# Altium project MB1404.PrjPcb (part 1 of 4)
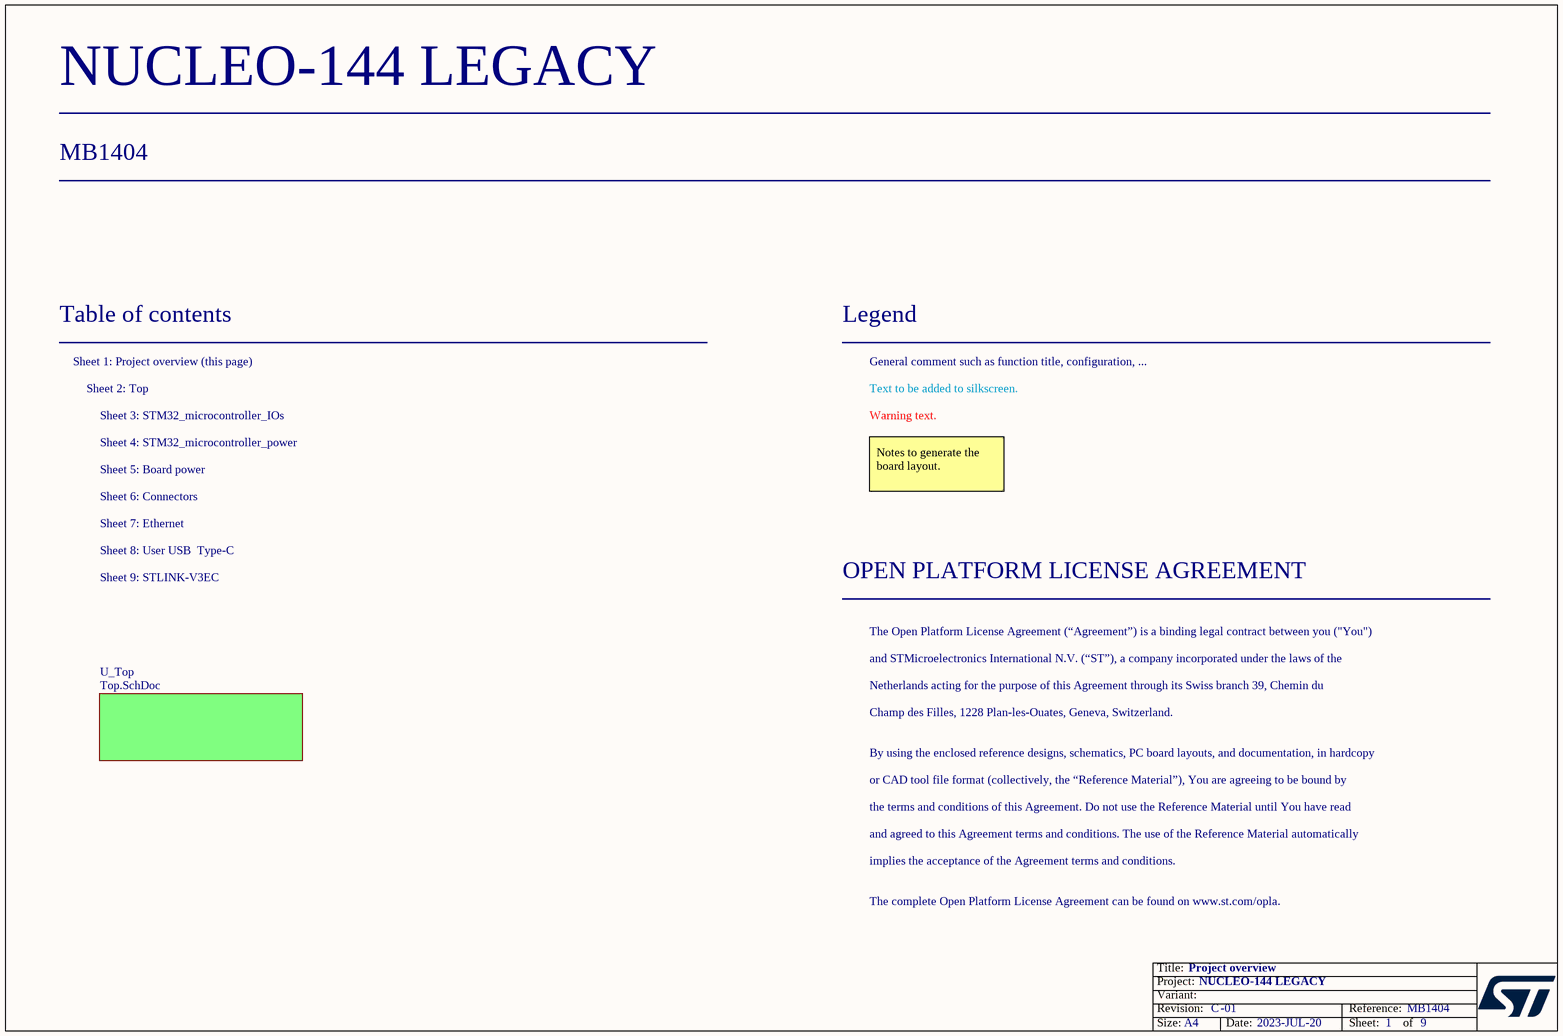
[diagram p0: Project_Overview.SchDoc]
Board_Assembly_Revision: 01; Board_Document_Date: 2023-JUL-20; Board_Name: NUCLEO-144 LEGACY; Board_PCB_Revision: C; Board_Reference: MB1404
9 sheets, 355 parts. Net scope: flat (ports and power ports of the same name join across sheets).
Board file: MB1404.PcbDoc
Sheets:
  Project_Overview.SchDoc
    U_Top = Top.SchDoc
      U_Connectors = Connectors.SchDoc
      U_USB = USB.SchDoc
      U_Ethernet = Ethernet.SchDoc
      U_STM32_microcontroller_power = STM32_microcontroller_power.SchDoc
      U_Board_power = Board_power.SchDoc
      U_STM32_microcontroller_IOs = STM32_microcontroller_IOs.SchDoc
      U_STLINK-V3EC = STLINK-V3EC.SchDoc

## Sheet Project_Overview.SchDoc: Project overview
size A4; Date: Not used; ApprovedBy: Not used; CheckedBy: Not used; Author: Not used; CompanyName: STMicroelectronics; DrawnBy: Not used; Engineer: Not used; Organization: Not used; Address1: Not used; Address2: Not used; Address3: Not used; Address4: Not used; DocumentNumber: 1; Revision: Not used; SheetNumber: 1; SheetTotal: 9; CurrentTime: Not used; CurrentDate: Not used; Time: Not used; DocumentFullPathAndName: Not used; DocumentName: Not used; ModifiedDate: Not used; ImagePath: Not used; ProjectName: Not used; Application_BuildNumber: Not used

### Sub-sheets
U_Top = Top.SchDoc: no entries

### Notes on the sheet
- Table of contents
- Sheet 1: Project overview (this page)
- Legend
- General comment such as function title, configuration, ...
- Sheet 2: Top
- Sheet 4: STM32_microcontroller_power
- Sheet 3: STM32_microcontroller_IOs
- Text to be added to silkscreen.
- Warning text.
- Sheet 6: Connectors
- Sheet 5: Board power
- Notes to generate the board layout.
- Sheet 9: STLINK-V3EC
- Sheet 8: User USB  Type-C
- Sheet 7: Ethernet
- OPEN PLATFORM LICENSE AGREEMENT
- The Open Platform License Agreement (“Agreement”) is a binding legal contract between you ("You")
- and STMicroelectronics International N.V. (“ST”), a company incorporated under the laws of the
- Netherlands acting for the purpose of this Agreement through its Swiss branch 39, Chemin du
- Champ des Filles, 1228 Plan-les-Ouates, Geneva, Switzerland.
- By using the enclosed reference designs, schematics, PC board layouts, and documentation, in hardcopy
- or CAD tool file format (collectively, the “Reference Material”), You are agreeing to be bound by
- the terms and conditions of this Agreement. Do not use the Reference Material until You have read
- and agreed to this Agreement terms and conditions. The use of the Reference Material automatically
- implies the acceptance of the Agreement terms and conditions.
- The complete Open Platform License Agreement can be found on www.st.com/opla.
- Title:
- Project:
- Size:
- Revision:
- Variant:
- A4
- -
- Date:
- Reference:
- Sheet:
- of

## Sheet Top.SchDoc: Top
size A4; Date: Not used; ApprovedBy: Not used; CheckedBy: Not used; Author: Not used; CompanyName: STMicroelectronics; DrawnBy: Not used; Engineer: Not used; Organization: Not used; Address1: Not used; Address2: Not used; Address3: Not used; Address4: Not used; DocumentNumber: 2; Revision: Not used; SheetNumber: 2; SheetTotal: 9; CurrentTime: Not used; CurrentDate: Not used; Time: Not used; DocumentFullPathAndName: Not used; DocumentName: Not used; ModifiedDate: Not used; ImagePath: Not used; ProjectName: Not used; Application_BuildNumber: Not used
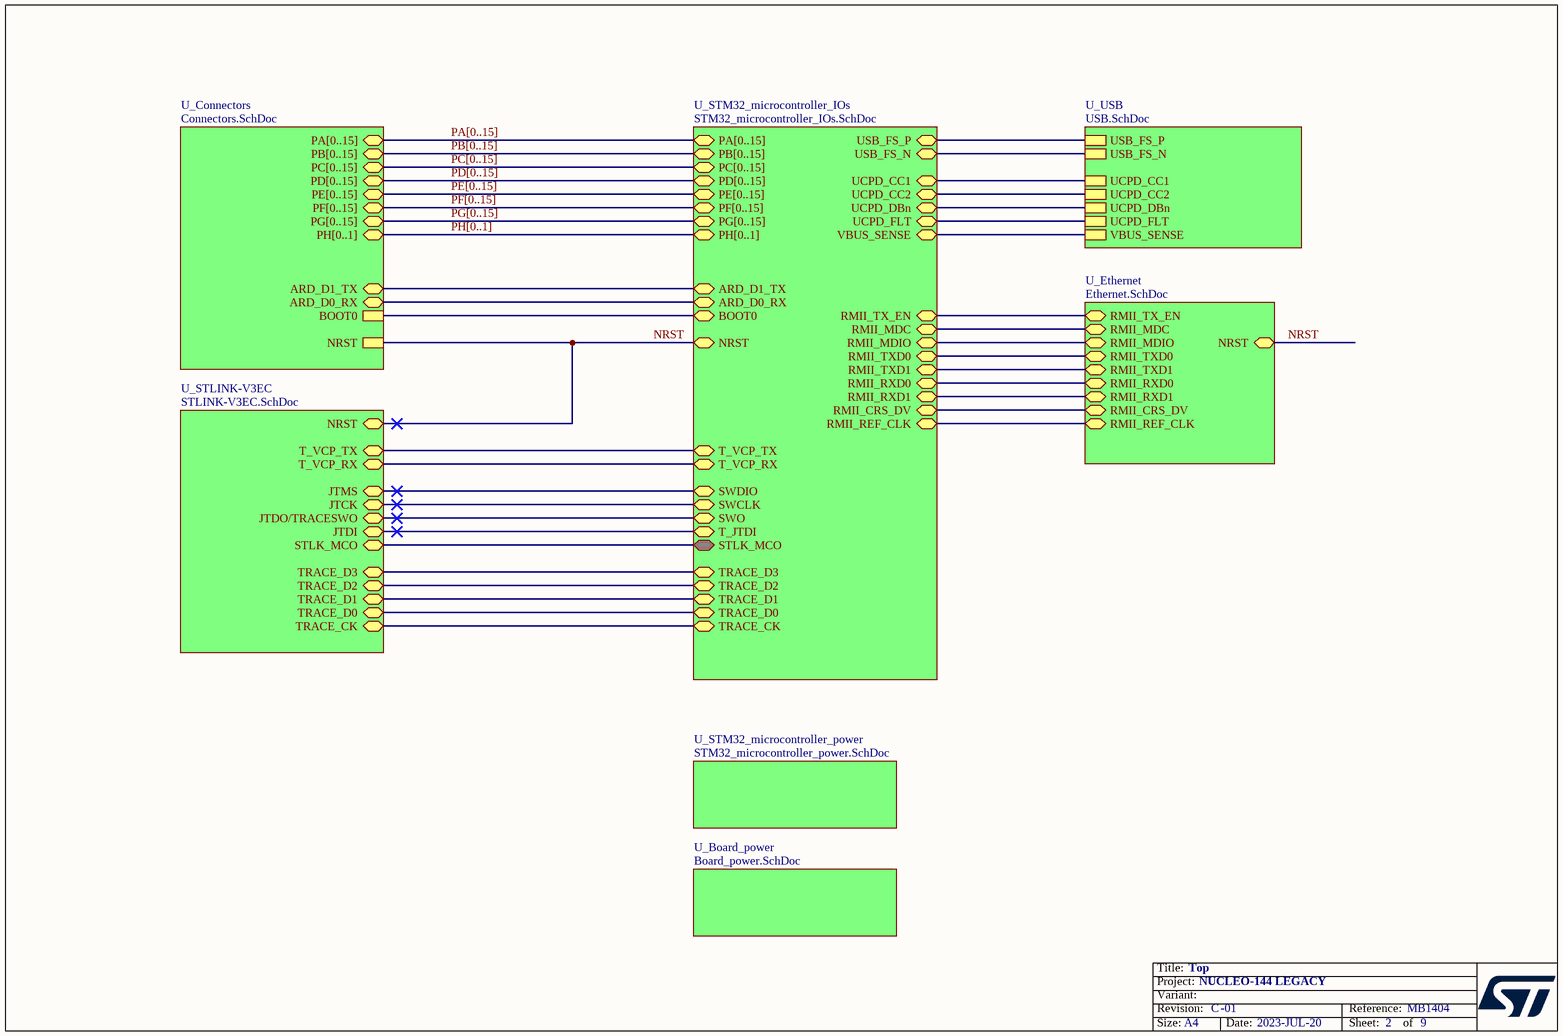
[diagram p1: Top.SchDoc]

### Sub-sheets
U_Board_power = Board_power.SchDoc: no entries
U_Connectors = Connectors.SchDoc: PA[0..15] (bidir), PB[0..15] (bidir), PC[0..15] (bidir), PD[0..15] (bidir), PE[0..15] (bidir), PH[0..1] (bidir), ARD_D1_TX (bidir), ARD_D0_RX (bidir), NRST, BOOT0, PF[0..15] (bidir), PG[0..15] (bidir)
U_Ethernet = Ethernet.SchDoc: RMII_CRS_DV (bidir), RMII_REF_CLK (bidir), RMII_TXD0 (bidir), RMII_RXD0 (bidir), RMII_TX_EN (bidir), NRST (bidir), RMII_RXD1 (bidir), RMII_MDC (bidir), RMII_TXD1 (bidir), RMII_MDIO (bidir)
U_STLINK-V3EC = STLINK-V3EC.SchDoc: STLK_MCO (bidir), NRST (bidir), JTCK (bidir), JTMS (bidir), JTDI (bidir), T_VCP_TX (bidir), T_VCP_RX (bidir), JTDO/TRACESWO (bidir), TRACE_CK (bidir), TRACE_D0 (bidir), TRACE_D1 (bidir), TRACE_D2 (bidir), TRACE_D3 (bidir)
U_STM32_microcontroller_IOs = STM32_microcontroller_IOs.SchDoc: NRST (bidir), PA[0..15] (bidir), PB[0..15] (bidir), PC[0..15] (bidir), PD[0..15] (bidir), PE[0..15] (bidir), PG[0..15] (bidir), PH[0..1] (bidir), SWCLK (bidir), BOOT0 (bidir), STLK_MCO (bidir), USB_FS_N (bidir), USB_FS_P (bidir), RMII_RXD0 (bidir), RMII_REF_CLK (bidir), RMII_CRS_DV (bidir), RMII_MDC (bidir), RMII_MDIO (bidir), RMII_RXD1 (bidir), RMII_TXD1 (bidir), RMII_TXD0 (bidir), RMII_TX_EN (bidir), SWDIO (bidir), SWO (bidir), PF[0..15] (bidir), T_VCP_RX (bidir), T_VCP_TX (bidir), ARD_D0_RX (bidir), ARD_D1_TX (bidir), T_JTDI (bidir), UCPD_CC1 (bidir), UCPD_CC2 (bidir), UCPD_DBn (bidir), UCPD_FLT (bidir), VBUS_SENSE (bidir), TRACE_CK (bidir), TRACE_D0 (bidir), TRACE_D1 (bidir), TRACE_D2 (bidir), TRACE_D3 (bidir)
U_STM32_microcontroller_power = STM32_microcontroller_power.SchDoc: no entries
U_USB = USB.SchDoc: USB_FS_N, USB_FS_P, UCPD_CC2, UCPD_FLT, UCPD_DBn, UCPD_CC1, VBUS_SENSE

### Nets
NRST: sheet U_Connectors/NRST, sheet U_Ethernet/NRST, sheet U_STM32_microcontroller_IOs/NRST, sheet U_STLINK-V3EC/NRST
(unnamed): sheet U_Connectors/ARD_D1_TX, sheet U_STM32_microcontroller_IOs/ARD_D1_TX
(unnamed): sheet U_Connectors/ARD_D0_RX, sheet U_STM32_microcontroller_IOs/ARD_D0_RX
(unnamed): sheet U_Connectors/BOOT0, sheet U_STM32_microcontroller_IOs/BOOT0
(unnamed): sheet U_USB/USB_FS_N, sheet U_STM32_microcontroller_IOs/USB_FS_N
(unnamed): sheet U_USB/USB_FS_P, sheet U_STM32_microcontroller_IOs/USB_FS_P
(unnamed): sheet U_USB/UCPD_CC2, sheet U_STM32_microcontroller_IOs/UCPD_CC2
(unnamed): sheet U_USB/UCPD_FLT, sheet U_STM32_microcontroller_IOs/UCPD_FLT
(unnamed): sheet U_USB/UCPD_DBn, sheet U_STM32_microcontroller_IOs/UCPD_DBn
(unnamed): sheet U_USB/UCPD_CC1, sheet U_STM32_microcontroller_IOs/UCPD_CC1
(unnamed): sheet U_USB/VBUS_SENSE, sheet U_STM32_microcontroller_IOs/VBUS_SENSE
(unnamed): sheet U_Ethernet/RMII_CRS_DV, sheet U_STM32_microcontroller_IOs/RMII_CRS_DV
(unnamed): sheet U_Ethernet/RMII_REF_CLK, sheet U_STM32_microcontroller_IOs/RMII_REF_CLK
(unnamed): sheet U_Ethernet/RMII_TXD0, sheet U_STM32_microcontroller_IOs/RMII_TXD0
(unnamed): sheet U_Ethernet/RMII_RXD0, sheet U_STM32_microcontroller_IOs/RMII_RXD0
(unnamed): sheet U_Ethernet/RMII_TX_EN, sheet U_STM32_microcontroller_IOs/RMII_TX_EN
(unnamed): sheet U_Ethernet/RMII_RXD1, sheet U_STM32_microcontroller_IOs/RMII_RXD1
(unnamed): sheet U_Ethernet/RMII_MDC, sheet U_STM32_microcontroller_IOs/RMII_MDC
(unnamed): sheet U_Ethernet/RMII_TXD1, sheet U_STM32_microcontroller_IOs/RMII_TXD1
(unnamed): sheet U_Ethernet/RMII_MDIO, sheet U_STM32_microcontroller_IOs/RMII_MDIO
(unnamed): sheet U_STM32_microcontroller_IOs/SWCLK, sheet U_STLINK-V3EC/JTCK
(unnamed): sheet U_STM32_microcontroller_IOs/STLK_MCO, sheet U_STLINK-V3EC/STLK_MCO
(unnamed): sheet U_STM32_microcontroller_IOs/SWDIO, sheet U_STLINK-V3EC/JTMS
(unnamed): sheet U_STM32_microcontroller_IOs/SWO, sheet U_STLINK-V3EC/JTDO/TRACESWO
(unnamed): sheet U_STM32_microcontroller_IOs/T_VCP_RX, sheet U_STLINK-V3EC/T_VCP_RX
(unnamed): sheet U_STM32_microcontroller_IOs/T_VCP_TX, sheet U_STLINK-V3EC/T_VCP_TX
(unnamed): sheet U_STM32_microcontroller_IOs/T_JTDI, sheet U_STLINK-V3EC/JTDI
(unnamed): sheet U_STM32_microcontroller_IOs/TRACE_CK, sheet U_STLINK-V3EC/TRACE_CK
(unnamed): sheet U_STM32_microcontroller_IOs/TRACE_D0, sheet U_STLINK-V3EC/TRACE_D0
(unnamed): sheet U_STM32_microcontroller_IOs/TRACE_D1, sheet U_STLINK-V3EC/TRACE_D1
(unnamed): sheet U_STM32_microcontroller_IOs/TRACE_D2, sheet U_STLINK-V3EC/TRACE_D2
(unnamed): sheet U_STM32_microcontroller_IOs/TRACE_D3, sheet U_STLINK-V3EC/TRACE_D3

### Buses and harness runs
bus PA[0..15] = sheet U_Connectors/PA[0..15] = sheet U_STM32_microcontroller_IOs/PA[0..15]
bus PB[0..15] = sheet U_Connectors/PB[0..15] = sheet U_STM32_microcontroller_IOs/PB[0..15]
bus PC[0..15] = sheet U_Connectors/PC[0..15] = sheet U_STM32_microcontroller_IOs/PC[0..15]
bus PD[0..15] = sheet U_Connectors/PD[0..15] = sheet U_STM32_microcontroller_IOs/PD[0..15]
bus PE[0..15] = sheet U_Connectors/PE[0..15] = sheet U_STM32_microcontroller_IOs/PE[0..15]
bus PF[0..15] = sheet U_Connectors/PF[0..15] = sheet U_STM32_microcontroller_IOs/PF[0..15]
bus PG[0..15] = sheet U_Connectors/PG[0..15] = sheet U_STM32_microcontroller_IOs/PG[0..15]
bus PH[0..1] = sheet U_Connectors/PH[0..1] = sheet U_STM32_microcontroller_IOs/PH[0..1]

### Notes on the sheet
- Title:
- Project:
- Size:
- Revision:
- Variant:
- A4
- -
- Date:
- Reference:
- Sheet:
- of

## Sheet Connectors.SchDoc: Connectors
size A3; Date: Not used; ApprovedBy: Not used; CheckedBy: Not used; Author: Not used; CompanyName: STMicroelectronics; DrawnBy: Not used; Engineer: Not used; Organization: Not used; Address1: Not used; Address2: Not used; Address3: Not used; Address4: Not used; DocumentNumber: 6; Revision: Not used; SheetNumber: 6; SheetTotal: 9; CurrentTime: Not used; CurrentDate: Not used; Time: Not used; DocumentFullPathAndName: Not used; DocumentName: Not used; ModifiedDate: Not used; ImagePath: Not used; ProjectName: Not used; Application_BuildNumber: Not used
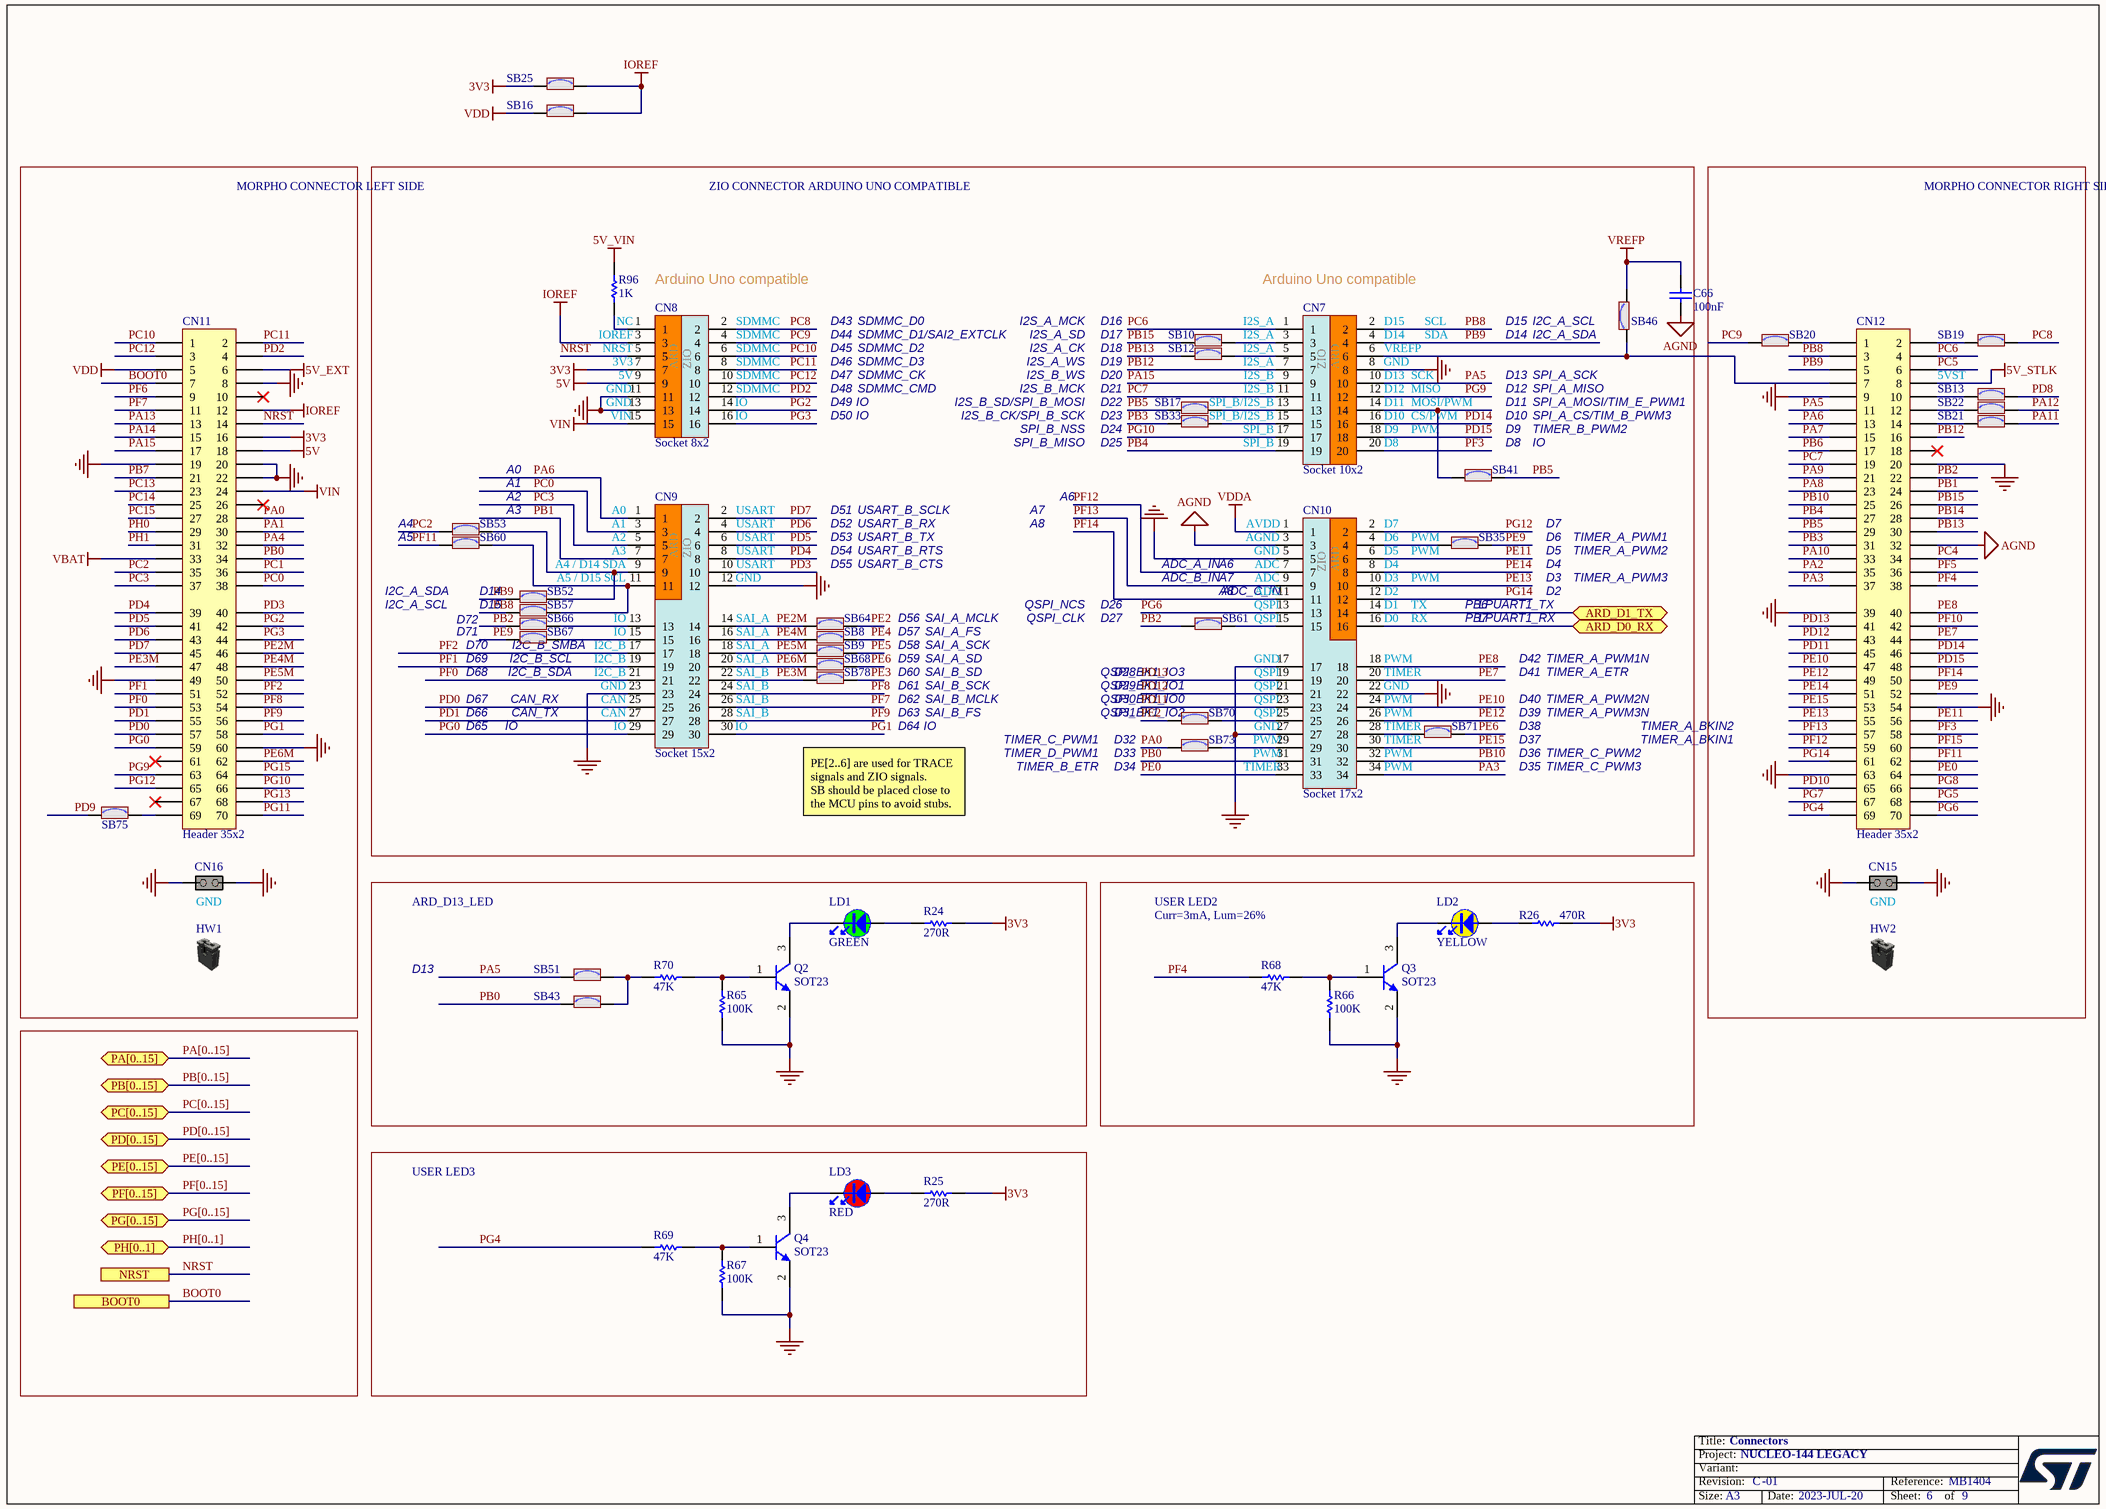
[diagram p2: Connectors.SchDoc]

### Parts
C66  value 100nF  [C0603]  (hidden comment: Capacitor)
CN7  value Socket 10x2  [CON_SAMTEC_SSQ-110-23-F-D]  (hidden comment: Socket 10x2_N144_ARD)
CN8  value Socket 8x2  [CON_SAMTEC_SSQ-108-23-F-D]  (hidden comment: Socket 8x2_N144_ARD)
CN9  value Socket 15x2  [CON_SAMTEC_SSQ-115-23-F-D]  (hidden comment: Socket 15x2_N144_ARD)
CN10  value Socket 17x2  [CON_SAMTEC_SSQ-117-23-F-D]  (hidden comment: Socket 17x2_N144_ARD)
CN11  Header 35x2  [CON_SAMTEC_TSW-135-07-X-D]
CN12  Header 35x2  [CON_SAMTEC_TSW-135-07-X-D]
CN15  Jumper_Header 2x1  [CON_SAMTEC_TSW-102-09-X-S]  (value not drawn)
CN16  Jumper_Header 2x1  [CON_SAMTEC_TSW-102-09-X-S]  (value not drawn)
HW1  Shunt Black 2.54mm  (value not drawn)  (mechanical)
HW2  Shunt Black 2.54mm  (value not drawn)  (mechanical)
LD1  value GREEN  [LED_0603_OSRAM_LG-Q396-PS-35_GREEN_1A2K_H0P4]  (hidden comment: LED_green)
LD2  value YELLOW  [LED_0603_OSRAM_LY-Q396-P1Q2-36_YELLOW_1A2K_H0P4]  (hidden comment: LED_yellow)
LD3  value RED  [LED_0603_OSRAM_LS-Q976-NR-1_RED_1A2K_H0P8]  (hidden comment: LED_red)
Q2  value SOT23  [NPN_SOT23]  (hidden comment: 9013-SOT23)
Q3  value SOT23  [NPN_SOT23]  (hidden comment: 9013-SOT23)
Q4  value SOT23  [NPN_SOT23]  (hidden comment: 9013-SOT23)
R24  value 270R  [R0402]  (hidden comment: Resistor)
R25  value 270R  [R0402]  (hidden comment: Resistor)
R26  value 470R  [R0402]  (hidden comment: Resistor)
R65  value 100K  [R0603]  (hidden comment: Resistor)
R66  value 100K  [R0603]  (hidden comment: Resistor)
R67  value 100K  [R0603]  (hidden comment: Resistor)
R68  value 47K  [R0603]  (hidden comment: Resistor)
R69  value 47K  [R0603]  (hidden comment: Resistor)
R70  value 47K  [R0603]  (hidden comment: Resistor)
R96  value 1K  [R0402]  (hidden comment: Resistor)
SB8  SB_ON  [SOLDER-BRIDGE_R0402-0R]  (value not drawn)
SB9  SB_ON  [SOLDER-BRIDGE_R0402-0R]  (value not drawn)
SB10  SB_ON  [SOLDER-BRIDGE_R0603-0R]  (value not drawn)
SB12  SB_ON  [SOLDER-BRIDGE_R0603-0R]  (value not drawn)
SB13  SB_ON  [SOLDER-BRIDGE_R0402-0R]  (value not drawn)
SB16  SB_ON  [SOLDER-BRIDGE_R0603-0R]  (value not drawn)
SB17  SB_ON  [SOLDER-BRIDGE_R0603-0R]  (value not drawn)
SB19  SB_ON  [SOLDER-BRIDGE_R0603-0R]  (value not drawn)
SB20  SB_ON  [SOLDER-BRIDGE_R0402-0R]  (value not drawn)
SB21  SB_ON  [SOLDER-BRIDGE_R0402-0R]  (value not drawn)
SB22  SB_ON  [SOLDER-BRIDGE_R0402-0R]  (value not drawn)
SB25  SB_ON  [SOLDER-BRIDGE_R0603-0R]  (value not drawn)
SB33  SB_ON  [SOLDER-BRIDGE_R0402-0R]  (value not drawn)
SB35  SB_ON  [SOLDER-BRIDGE_R0402-0R]  (value not drawn)
SB41  SB_ON  [SOLDER-BRIDGE_R0603-0R]  (value not drawn)
SB43  SB_ON  [SOLDER-BRIDGE_R0603-0R]  (value not drawn)
SB46  SB_ON  [SOLDER-BRIDGE_R0603-0R]  (value not drawn)
SB51  SB_ON  [SOLDER-BRIDGE_R0603-0R]  (value not drawn)
SB52  SB_ON  [SOLDER-BRIDGE_R0402-0R]  (value not drawn)
SB53  SB_ON  [SOLDER-BRIDGE_R0402-0R]  (value not drawn)
SB57  SB_ON  [SOLDER-BRIDGE_R0402-0R]  (value not drawn)
SB60  SB_ON  [SOLDER-BRIDGE_R0402-0R]  (value not drawn)
SB61  SB_ON  [SOLDER-BRIDGE_R0402-0R]  (value not drawn)
SB64  SB_ON  [SOLDER-BRIDGE_R0402-0R]  (value not drawn)
SB66  SB_ON  [SOLDER-BRIDGE_R0402-0R]  (value not drawn)
SB67  SB_ON  [SOLDER-BRIDGE_R0402-0R]  (value not drawn)
SB68  SB_ON  [SOLDER-BRIDGE_R0402-0R]  (value not drawn)
SB70  SB_ON  [SOLDER-BRIDGE_R0402-0R]  (value not drawn)
SB71  SB_ON  [SOLDER-BRIDGE_R0402-0R]  (value not drawn)
SB73  SB_ON  [SOLDER-BRIDGE_R0402-0R]  (value not drawn)
SB75  SB_ON  [SOLDER-BRIDGE_R0402-0R]  (value not drawn)
SB78  SB_ON  [SOLDER-BRIDGE_R0402-0R]  (value not drawn)

### Blocks framed on the sheet
USER LED3: LD3 Q4 R25 R67 R69

### Ports
ARD_D0_RX (bidir), ARD_D1_TX (bidir), BOOT0, NRST, PA[0..15] (bidir), PB[0..15] (bidir), PC[0..15] (bidir), PD[0..15] (bidir), PE[0..15] (bidir), PF[0..15] (bidir), PG[0..15] (bidir), PH[0..1] (bidir)

### Nets
3V3: CN8.7 CN11.16 R24.2 R25.2 R26.2 SB25.1
5V: CN8.9 CN11.18
5V_EXT: CN11.6
5V_STLK: CN12.8
5V_VIN: R96.2
AGND: C66.1 CN10.3 CN12.32
GND: CN7.8 CN8.11 CN8.13 CN9.12 CN9.23 CN10.5 CN10.17 CN10.22 CN10.27 CN11.8 CN11.19 CN11.20 CN11.22 CN11.49 CN11.60 CN12.9 CN12.20 CN12.39 CN12.54 CN12.63 CN15.1(COMMON) CN15.2(NO) CN16.1(COMMON) CN16.2(NO) Q2.2(E) Q3.2(E) Q4.2(E) R65.1 R66.1 R67.1
IOREF: CN8.3 CN11.12 SB16.2 SB25.2
VBAT: CN11.33
VDD: CN11.5 SB16.1
VDDA: CN10.1
VIN: CN8.15 CN11.24
VREFP: C66.2 SB46.2
ARD_D0_RX: CN10.16 ; port ARD_D0_RX
ARD_D1_TX: CN10.14 ; port ARD_D1_TX
BOOT0: CN11.7 ; port BOOT0
NRST: CN8.5 CN11.14 ; port NRST
PA0: CN11.28 SB73.1
PA1: CN11.30
PA2: CN12.35
PA3: CN10.34 CN12.37
PA4: CN11.32
PA5: CN7.10 CN12.11 SB51.1
PA6: CN9.1 CN12.13
PA7: CN12.15
PA8: CN12.23
PA9: CN12.21
PA10: CN12.33
PA11: SB21.2
PA12: SB22.2
PA13: CN11.13
PA14: CN11.15
PA15: CN7.9 CN11.17
PB0: CN10.31 CN11.34 SB43.1
PB1: CN9.7 CN12.24
PB2: CN12.22 SB61.1 SB66.1
PB3: CN12.31 SB33.1
PB4: CN7.19 CN12.27
PB5: CN12.29 SB17.1 SB41.2
PB6: CN12.17
PB7: CN11.21
PB8: CN7.2 CN12.3 SB57.1
PB9: CN7.4 CN12.5 SB52.1
PB10: CN10.32 CN12.25
PB12: CN7.7 CN12.16
PB13: CN12.30 SB12.1
PB14: CN12.28
PB15: CN12.26 SB10.1
PC0: CN9.3 CN11.38
PC1: CN11.36
PC2: CN11.35 SB53.1
PC3: CN9.5 CN11.37
PC4: CN12.34
PC5: CN12.6
PC6: CN7.1 CN12.4
PC7: CN7.11 CN12.19
PC8: CN8.2 SB19.2
PC9: CN8.4 SB20.1
PC10: CN8.6 CN11.1
PC11: CN8.8 CN11.2
PC12: CN8.10 CN11.3
PC13: CN11.23
PC14: CN11.25
PC15: CN11.27
PD0: CN9.25 CN11.57
PD1: CN9.27 CN11.55
PD2: CN8.12 CN11.4
PD3: CN9.10 CN11.40
PD4: CN9.8 CN11.39
PD5: CN9.6 CN11.41
PD6: CN9.4 CN11.43
PD7: CN9.2 CN11.45
PD8: SB13.2
PD9: SB75.1
PD10: CN12.65
PD11: CN10.23 CN12.45
PD12: CN10.21 CN12.43
PD13: CN10.19 CN12.41
PD14: CN7.16 CN12.46
PD15: CN7.18 CN12.48
PE0: CN10.33 CN12.64
PE2: SB64.2 SB70.1
PE2M: CN9.14 CN11.46 SB64.1
PE3: SB78.2
PE3M: CN9.22 CN11.47 SB78.1
PE4: SB8.2
PE4M: CN9.16 CN11.48 SB8.1
PE5: SB9.2
PE5M: CN9.18 CN11.50 SB9.1
PE6: SB68.2 SB71.2
PE6M: CN9.20 CN11.62 SB68.1
PE7: CN10.20 CN12.44
PE8: CN10.18 CN12.40
PE9: CN12.52 SB35.2 SB67.1
PE10: CN10.24 CN12.47
PE11: CN10.6 CN12.56
PE12: CN10.26 CN12.49
PE13: CN10.10 CN12.55
PE14: CN10.8 CN12.51
PE15: CN10.30 CN12.53
PF0: CN9.21 CN11.53
PF1: CN9.19 CN11.51
PF2: CN9.17 CN11.52
PF3: CN7.20 CN12.58
PF4: CN12.38 R68.1
PF5: CN12.36
PF6: CN11.9
PF7: CN9.26 CN11.11
PF8: CN9.24 CN11.54
PF9: CN9.28 CN11.56
PF10: CN12.42
PF11: CN12.62 SB60.1
PF12: CN10.7 CN12.59
PF13: CN10.9 CN12.57
PF14: CN10.11 CN12.50
PF15: CN12.60
PG0: CN9.29 CN11.59
PG1: CN9.30 CN11.58
PG2: CN8.14 CN11.42
PG3: CN8.16 CN11.44
PG4: CN12.69 R69.1
PG5: CN12.68
PG6: CN10.13 CN12.70
PG7: CN12.67
PG8: CN12.66
PG9: CN7.12 CN11.63
PG10: CN7.17 CN11.66
PG11: CN11.70
PG12: CN10.2 CN11.65
PG13: CN11.68
PG14: CN10.12 CN12.61
PG15: CN11.64
PH0: CN11.29
PH1: CN11.31
NetCN7_3: CN7.3 SB10.2
NetCN7_5: CN7.5 SB12.2
NetCN7_6: CN7.6 CN12.7 SB46.1
NetCN7_13: CN7.13 SB17.2
NetCN7_14: CN7.14 SB41.1
NetCN7_15: CN7.15 SB33.2
NetCN8_1: CN8.1 R96.1
NetCN9_9: CN9.9 SB52.2 SB53.2
NetCN9_11: CN9.11 SB57.2 SB60.2
NetCN9_13: CN9.13 SB66.2
NetCN9_15: CN9.15 SB67.2
NetCN10_4: CN10.4 SB35.1
NetCN10_15: CN10.15 SB61.2
NetCN10_25: CN10.25 SB70.2
NetCN10_28: CN10.28 SB71.1
NetCN10_29: CN10.29 SB73.2
NetCN11_69: CN11.69 SB75.2
NetCN12_1: CN12.1 SB20.2
NetCN12_2: CN12.2 SB19.1
NetCN12_10: CN12.10 SB13.1
NetCN12_12: CN12.12 SB22.1
NetCN12_14: CN12.14 SB21.1
NetLD1_1: LD1.1 R24.1
NetLD1_2: LD1.2 Q2.3(C)
NetLD2_1: LD2.1 R26.1
NetLD2_2: LD2.2 Q3.3(C)
NetLD3_1: LD3.1 R25.1
NetLD3_2: LD3.2 Q4.3(C)
NetQ2_1: Q2.1(B) R65.2 R70.2
NetQ3_1: Q3.1(B) R66.2 R68.2
NetQ4_1: Q4.1(B) R67.2 R69.2
NetR70_1: R70.1 SB43.2 SB51.2

Not connected (* = marked no-connect by the designer): CN11 10* 26* 61* 67*; CN12 18*

### Buses and harness runs
bus PA[0..15] = port PA[0..15]
bus PB[0..15] = port PB[0..15]
bus PC[0..15] = port PC[0..15]
bus PD[0..15] = port PD[0..15]
bus PE[0..15] = port PE[0..15]
bus PF[0..15] = port PF[0..15]
bus PG[0..15] = port PG[0..15]
bus PH[0..1] = port PH[0..1]

### Notes on the sheet
- MORPHO CONNECTOR LEFT SIDE
- ZIO CONNECTOR ARDUINO UNO COMPATIBLE
- MORPHO CONNECTOR RIGHT SIDE
- Arduino Uno compatible
- (near CN7) Arduino Uno compatible
- NC
- IOREF
- (near CN8) NRST
- (near CN8) 3V3
- (near CN8) 5V
- (near CN8) SDMMC
- D43
- D44
- D45
- D46
- D47
- SDMMC_CK
- SDMMC_D0
- SDMMC_D1/SAI2_EXTCLK
- SDMMC_D2
- SDMMC_D3
- I2S_A_SD
- I2S_A_CK
- I2S_A_WS
- I2S_A_MCK
- I2S_B_WS
- D16
- D17
- D18
- D19
- D20
- I2S_A
- I2S_B
- (near CN7) VREFP
- (near CN7) D13
- (near CN7) D14
- (near CN7) D15
- SCK
- (near CN7) GND
- SCL
- SDA
- D15
- D14
- D13
- SPI_A_SCK
- (near SB46) I2C_A_SCL
- (near SB46) I2C_A_SDA
- 5VST
- (near CN8) GND
- (near CN8) VIN
- (near CN8) IO
- D48
- D49
- D50
- SDMMC_CMD
- IO
- I2S_B_SD/SPI_B_MOSI
- I2S_B_CK/SPI_B_SCK
- I2S_B_MCK
- SPI_B_MISO
- SPI_B_NSS
- D21
- D22
- D23
- D24
- D25
- SPI_B/I2S_B
- SPI_B
- (near SB17) SPI_B/I2S_B
- (near CN7) D8
- (near CN7) D9
- (near CN7) D10
- (near CN7) D11
- (near CN7) D12
- MISO
- MOSI/PWM
- CS/PWM
- PWM
- D12
- D11
- D10
- (near SB41) D9
- (near SB41) D8
- TIMER_B_PWM2
- SPI_A_CS/TIM_B_PWM3
- SPI_A_MOSI/TIM_E_PWM1
- SPI_A_MISO
- (near SB41) IO
- A0
- A1
- A2
- A3
- (near CN9) A0
- (near CN9) USART
- D51
- USART_B_SCLK
- A7
- A6
- A4
- A5
- (near CN9) A1
- (near CN9) A2
- (near CN9) A3
- A4 / D14 SDA
- A5 / D15 SCL
- (near CN9) GND
- D52
- D53
- D54
- D55
- USART_B_TX
- USART_B_RX
- USART_B_CTS
- USART_B_RTS
- A8
- ADC_A_IN
- (near SB61) ADC_B_IN
- (near CN10) GND
- (near CN10) AVDD
- (near CN10) AGND
- (near CN10) ADC
- (near CN10) D7
- (near CN10) D6
- (near CN10) D5
- (near CN10) D4
- (near CN10) D3
- (near SB35) PWM
- D5
- D6
- D7
- D4
- D3
- TIMER_A_PWM1
- TIMER_A_PWM2
- TIMER_A_PWM3
- I2C_A_SCL
- I2C_A_SDA
- D72
- D71
- D70
- (near SB67) I2C_B_SMBA
- (near CN9) I2C_B
- (near CN9) IO
- (near CN9) SAI_A
- D56
- D57
- D58
- SAI_A_SCK
- SAI_A_FS
- SAI_A_MCLK
- QSPI_CLK
- QSPI_NCS
- D26
- D27
- (near SB61) ADC_C_IN
- (near SB61) A8
- (near CN10) QSPI
- QSPI
- (near CN10) D2
- (near CN10) D1
- (near CN10) D0
- TX
- RX
- PB6
- PB7
- LPUART1_TX
- LPUART1_RX
- D2
- D69
- D68
- D67
- D66
- CAN_TX
- CAN_RX
- (near SB67) I2C_B_SCL
- I2C_B_SDA
- (near CN9) CAN
- (near CN9) SAI_B
- D59
- D60
- D61
- D62
- D63
- SAI_A_SD
- SAI_B_SD
- SAI_B_SCK
- SAI_B_FS
- SAI_B_MCLK
- QSPI_BK1_IO0
- QSPI_BK1_IO2
- QSPI_BK1_IO1
- QSPI_BK1_IO3
- D28
- D29
- D30
- D31
- (near CN10) TIMER
- (near CN10) PWM
- GND
- D39
- D40
- D41
- D42
- TIMER_A_PWM1N
- TIMER_A_PWM2N
- TIMER_A_PWM3N
- TIMER_A_ETR
- D65
- D64
- TIMER_D_PWM1
- TIMER_B_ETR
- TIMER_C_PWM1
- D32
- D33
- D34
- TIMER
- (near SB71) TIMER
- D35
- D36
- D37
- D38
- TIMER_C_PWM2
- TIMER_C_PWM3
- TIMER_A_BKIN1
- TIMER_A_BKIN2
- PE[2..6] are used for TRACE signals and ZIO signals.
  SB should be placed close to the MCU pins to avoid stubs.
- (near CN16) GND
- ARD_D13_LED
- USER LED2
- Curr=3mA, Lum=26%
- (near CN15) GND
- Title:
- Project:
- Size:
- Revision:
- Variant:
- -
- Date:
- Reference:
- Sheet:
- of
- (in symbol MCD-02951) ARD; ZIO
- (in symbol MCD-02952) ARD; ZIO
- (in symbol MCD-02953) ZIO; ARD
- (in symbol MCD-02954) ZIO; ARD

### Library data of the parts
C66 = MCD-02119: Capacitor, MLCC, 100nF, 6V3, X5R, +/-10%, 0603, T=0.8mm; Part_Preference: Recommended; Manufacturer: KEMET; Manufacturer_Part_Number: C0603C104K9PACTU; Component_Country_Of_Origin: Mexico; ShowFields: YES; ID: 4219; Internal_Part_Number: MCD-02119; Status: Checked; Part_Type: Capacitor; Package: 0603; ComponentLink1URL: http://tunmcdsvn.tun.st.com/Component_Documentation_Library/Trunk/Capacitor/KEMET_X5R_Series/C0603C104K9PACTU; Order_Code_Digikey: N/A; Order_Code_Farnell: 2941311; Order_Code_RS: N/A
CN7 = MCD-02953: Socket, 10x2, 2.54mm, VR, TH, T=8.51mm/10mm; Part_Type: Connector; Part_Preference: Recommended; Manufacturer: SAMTEC; Manufacturer_Part_Number: SSQ-110-23-F-D; ShowFields: YES; ID: 5069; Internal_Part_Number: MCD-02953; Status: New; ComponentLink1URL: http://tunmcdsvn.tun.st.com/Component_Documentation_Library/Trunk/Connector/SAMTEC_SSQ_Series/; Order_Code_Digikey: SSQ-110-23-F-D-ND; Order_Code_Farnell: N/A; Order_Code_RS: N/A
CN8 = MCD-02951: Socket, 8x2, 2.54mm, VR, TH, T=8.51mm/10mm; Part_Type: Connector; Part_Preference: Recommended; Manufacturer: SAMTEC; Manufacturer_Part_Number: SSQ-108-23-F-D; ShowFields: YES; ID: 5067; Internal_Part_Number: MCD-02951; Status: New; ComponentLink1URL: http://tunmcdsvn.tun.st.com/Component_Documentation_Library/Trunk/Connector/SAMTEC_SSQ_Series/; Order_Code_Digikey: SSQ-108-23-F-D-ND; Order_Code_Farnell: N/A; Order_Code_RS: N/A
CN9 = MCD-02952: Socket, 15x2, 2.54mm, VR, TH, T=8.51mm/10mm; Part_Type: Connector; Part_Preference: Recommended; Manufacturer: SAMTEC; Manufacturer_Part_Number: SSQ-115-23-F-D; ShowFields: YES; ID: 5068; Internal_Part_Number: MCD-02952; Status: New; ComponentLink1URL: http://tunmcdsvn.tun.st.com/Component_Documentation_Library/Trunk/Connector/SAMTEC_SSQ_Series/; Order_Code_Digikey: SSQ-115-23-F-D-ND; Order_Code_Farnell: N/A; Order_Code_RS: N/A
CN10 = MCD-02954: Socket, 17x2, 2.54mm, VR, TH, T=8.51mm/10mm; Part_Type: Connector; Part_Preference: Recommended; Manufacturer: SAMTEC; Manufacturer_Part_Number: SSQ-117-23-F-D; ShowFields: YES; ID: 5070; Internal_Part_Number: MCD-02954; Status: New; ComponentLink1URL: http://tunmcdsvn.tun.st.com/Component_Documentation_Library/Trunk/Connector/SAMTEC_SSQ_Series/; Order_Code_Digikey: SSQ-117-23-F-D-ND; Order_Code_Farnell: N/A; Order_Code_RS: N/A
CN11 CN12 = MCD-01210: Header, 35x2, 2,54mm, VR, TH, Height 5.84mm/2.54mm; Part_Type: Connector; Manufacturer_Part_Number: TSW-135-07-x-D; Manufacturer: SAMTEC; Provided_By: SUBCO; Internal_Part_Number: MCD-01210; Value: Header 35x2; Status: Released; ComponentLink1Description: Datasheet; ComponentLink1URL: http://tunmcdsvn.tun.st.com/Component_Datasheet_Library/Trunk/Connectors/Samtec_TSW-HTSW-series; ECCN_US: n/a; ECCN_EU: n/a
CN15 CN16 = MCD-00214: Header, 2x1, 2,54mm, VR, TH, Height 5.84mm/10.16mm; Manufacturer_Part_Number: TSW-102-09-x-S; Manufacturer: SAMTEC; Part_Type: Connector; Value: Header 2x1 16mm; Provided_By: SUBCO; Internal_Part_Number: MCD-00214; ComponentLink1Description: Datasheet; Status: Released; ComponentLink1URL: http://tunmcdsvn.tun.st.com/Component_Datasheet_Library/Trunk/Connectors/Samtec_TSW-HTSW-series; ECCN_US: n/a; ECCN_EU: n/a
HW1 HW2 = MCD-00043: SHUNT 2.54mm BLACK; Manufacturer_Part_Number: SNT-100-BK-G; Manufacturer: SAMTEC; Part_Type: Mechanical; Alternate_Manufacturer_Part_Number: 316102S111A; Alternate_Manufacturer: JIUBABA; Provided_By: SUBCO; Value: SNT-100-BK-G; Internal_Part_Number: MCD-00043; ComponentLink1Description: Datasheet; Status: Released; ComponentLink1URL: http://tunmcdsvn.tun.st.com/Component_Datasheet_Library/Trunk/Connectors/Samtec_Shunt_Jumper_SNT100; ECCN_US: n/a; ECCN_EU: n/a
LD1 = MCD-00588: LED Green, 0603 SMD, Forward Voltage Typ=2V, Max=2.5V; Part_Type: Display; Manufacturer_Part_Number: LG Q396-PS-35; Manufacturer: OSRAM OPTO SEMICONDUCTORS; Alternate_Manufacturer_Part_Number: VLMTG1300-GS08; Alternate_Manufacturer: VISHAY SEMICONDUCTOR OPTO DIVISION; Provided_By: SUBCO; Internal_Part_Number: MCD-00588; Status: Released; Package: LED 0603; ComponentLink1Description: Datasheet; ComponentLink1URL: http://tunmcdsvn.tun.st.com/Component_Datasheet_Library/Trunk/Display/OSRAM_LED_GREEN_LG Q396-PS-35; Order_Code_Digikey: LG Q396-PS-35-ND; ECCN_US: n/a; ECCN_EU: n/a
LD2 = MCD-01061: LED Yellow, 0603 SMD, Forward Voltage min=1.7V, Typ=2V, Max=2.3V; Part_Type: Display; Manufacturer_Part_Number: LY Q396-P1Q2-36; Manufacturer: OSRAM OPTO SEMICONDUCTORS; Provided_By: SUBCO; Internal_Part_Number: MCD-01061; Status: Released; ComponentLink1Description: Datasheet; ComponentLink1URL: http://tunmcdsvn.tun.st.com/Component_Datasheet_Library/Trunk/Display/OSRAM_LED_0603_YELLOW_LY Q396-P1Q2-36; ECCN_US: n/a; ECCN_EU: n/a
LD3 = MCD-00586: LED Red, 0603 SMD, Forward Voltage Typ=2V, Max=2.5V; Part_Type: Display; Manufacturer_Part_Number: LS Q976-NR-1; Manufacturer: OSRAM OPTO SEMICONDUCTORS; Alternate_Manufacturer_Part_Number: VLMS1300-GS08; Alternate_Manufacturer: VISHAY SEMICONDUCTOR OPTO DIVISION; Provided_By: SUBCO; Internal_Part_Number: MCD-00586; Status: Released; Package: LED 0603; ComponentLink1Description: Datasheet; ComponentLink1URL: http://tunmcdsvn.tun.st.com/Component_Datasheet_Library/Trunk/Display/OSRAM_LED_RED_LS Q976-NR-1; Order_Code_Digikey: 475-2512-1-ND; ECCN_US: n/a; ECCN_EU: n/a
Q2-Q4 = MCD-00073: NPN Bipolar Transistor; Part_Type: IC; Manufacturer_Part_Number: BSR14; Manufacturer: ON SEMICONDUCTOR; Alternate_Manufacturer_Part_Number: MMBT2222ALT1G / MMBT2222ALT3G; Provided_By: SUBCO; ECCN_US: EAR99; ECCN_EU: NEC; Revision: *; Internal_Part_Number: MCD-00073; Status: Released; ComponentLink1Description: Datasheet; ComponentLink1URL: http://tunmcdsvn.tun.st.com/Component_Datasheet_Library/Trunk/IC/NXP_Transistor_BSR14; Alternate_Manufacturer: ON SEMICONDUCTOR
R24 R25 = MCD-00441: Resistor,270R,0402,1%,1/16W; Manufacturer_Part_Number: RC0402FR-07270RL; Manufacturer: YAGEO; Provided_By: SUBCO; ECCN_US: EAR99; ECCN_EU: NEC; Internal_Part_Number: MCD-00441; Status: Released; Part_Type: Resistor; Package: R0402; ComponentLink1Description: Datasheet; ComponentLink1URL: http://tunmcdsvn.tun.st.com/Component_Datasheet_Library/Trunk/Resistors/Yageo_Resistor_RC0402-series
R26 = MCD-00178: Resistor,470R,0402,1%,1/16W; Manufacturer_Part_Number: RC0402FR-07470RL; Manufacturer: YAGEO; Provided_By: SUBCO; ECCN_US: EAR99; ECCN_EU: NEC; Internal_Part_Number: MCD-00178; Status: Released; Part_Type: Resistor; Package: R0402; ComponentLink1Description: Datasheet; ComponentLink1URL: http://tunmcdsvn.tun.st.com/Component_Datasheet_Library/Trunk/Resistors/Yageo_Resistor_RC0402-series
R65-R67 = MCD-00223: Resistor,100K,0603,1%,1/10W; Manufacturer_Part_Number: RC0603FR-07100KL; Manufacturer: YAGEO; Provided_By: SUBCO; ECCN_US: EAR99; ECCN_EU: NEC; Internal_Part_Number: MCD-00223; Status: Released; Part_Type: Resistor; ComponentLink1Description: Datasheet; Package: R0603; ComponentLink1URL: http://tunmcdsvn.tun.st.com/Component_Datasheet_Library/Trunk/Resistors/Yageo_Resistor_RC0603-series
R68-R70 = MCD-00222: Resistor,47K,0603,1%,1/10W; Manufacturer_Part_Number: RC0603FR-0747KL; Manufacturer: YAGEO; Provided_By: SUBCO; ECCN_US: EAR99; ECCN_EU: NEC; Internal_Part_Number: MCD-00222; Status: Released; Part_Type: Resistor; ComponentLink1Description: Datasheet; Package: R0603; ComponentLink1URL: http://tunmcdsvn.tun.st.com/Component_Datasheet_Library/Trunk/Resistors/Yageo_Resistor_RC0603-series
R96 = MCD-00061: Resistor, 1K, 0402, +/-1%,1/16W; Part_Preference: Recommended; Manufacturer: YAGEO; Manufacturer_Part_Number: RC0402FR-071KL; Component_Country_Of_Origin: China; ShowFields: YES; ID: 2532; Internal_Part_Number: MCD-00061; Status: Released; Part_Type: Resistor; Package: 0402; ComponentLink1URL: http://tunmcdsvn.tun.st.com/Component_Documentation_Library/Trunk/Resistor/YAGEO_RC_L_Series; Order_Code_Digikey: 311-1.00KLRCT-ND; Order_Code_Farnell: 9239235; Order_Code_RS: N/A
SB8 SB9 SB13 SB20-SB22 SB33 SB35 SB52 SB53 SB57 SB60 SB61 SB64 SB66-SB68 SB70 SB71 SB73 SB75 SB78 = MCD-01618: Solder Bridge 0402 ON; Part_Type: Mechanical; Manufacturer_Part_Number: RC0402JR-070RL; Manufacturer: YAGEO; Provided_By: SUBCO; Internal_Part_Number: MCD-01618; Status: Footprint available; Package: SB0402; ComponentLink1Description: Datasheet; ComponentLink1URL: http://tunmcdsvn.tun.st.com/Component_Datasheet_Library/Trunk/Resistors/Yageo_Resistor_RC0402-series; ECCN_US: n/a; ECCN_EU: n/a
SB10 SB12 SB16 SB17 SB19 SB25 SB41 SB43 SB46 SB51 = MCD-00071: Solder Bridge ON; Part_Type: Mechanical; Manufacturer_Part_Number: RC0603JR-070RL; Manufacturer: YAGEO; Provided_By: SUBCO; Internal_Part_Number: MCD-00071; Status: Released; ComponentLink1Description: Datasheet; Package: SB0603; ComponentLink1URL: http://tunmcdsvn.tun.st.com/Component_Datasheet_Library/Trunk/Resistors/Yageo_Resistor_RC0603-series; ECCN_US: n/a; ECCN_EU: n/a

## Sheet USB.SchDoc: User USB Type-C
size A4; Date: Not used; ApprovedBy: Not used; CheckedBy: Not used; Author: Not used; CompanyName: STMicroelectronics; DrawnBy: Not used; Engineer: Not used; Organization: Not used; Address1: Not used; Address2: Not used; Address3: Not used; Address4: Not used; DocumentNumber: 8; Revision: Not used; SheetNumber: 8; SheetTotal: 9; CurrentTime: Not used; CurrentDate: Not used; Time: Not used; DocumentFullPathAndName: Not used; DocumentName: Not used; ModifiedDate: Not used; ImagePath: Not used; ProjectName: Not used; Application_BuildNumber: Not used
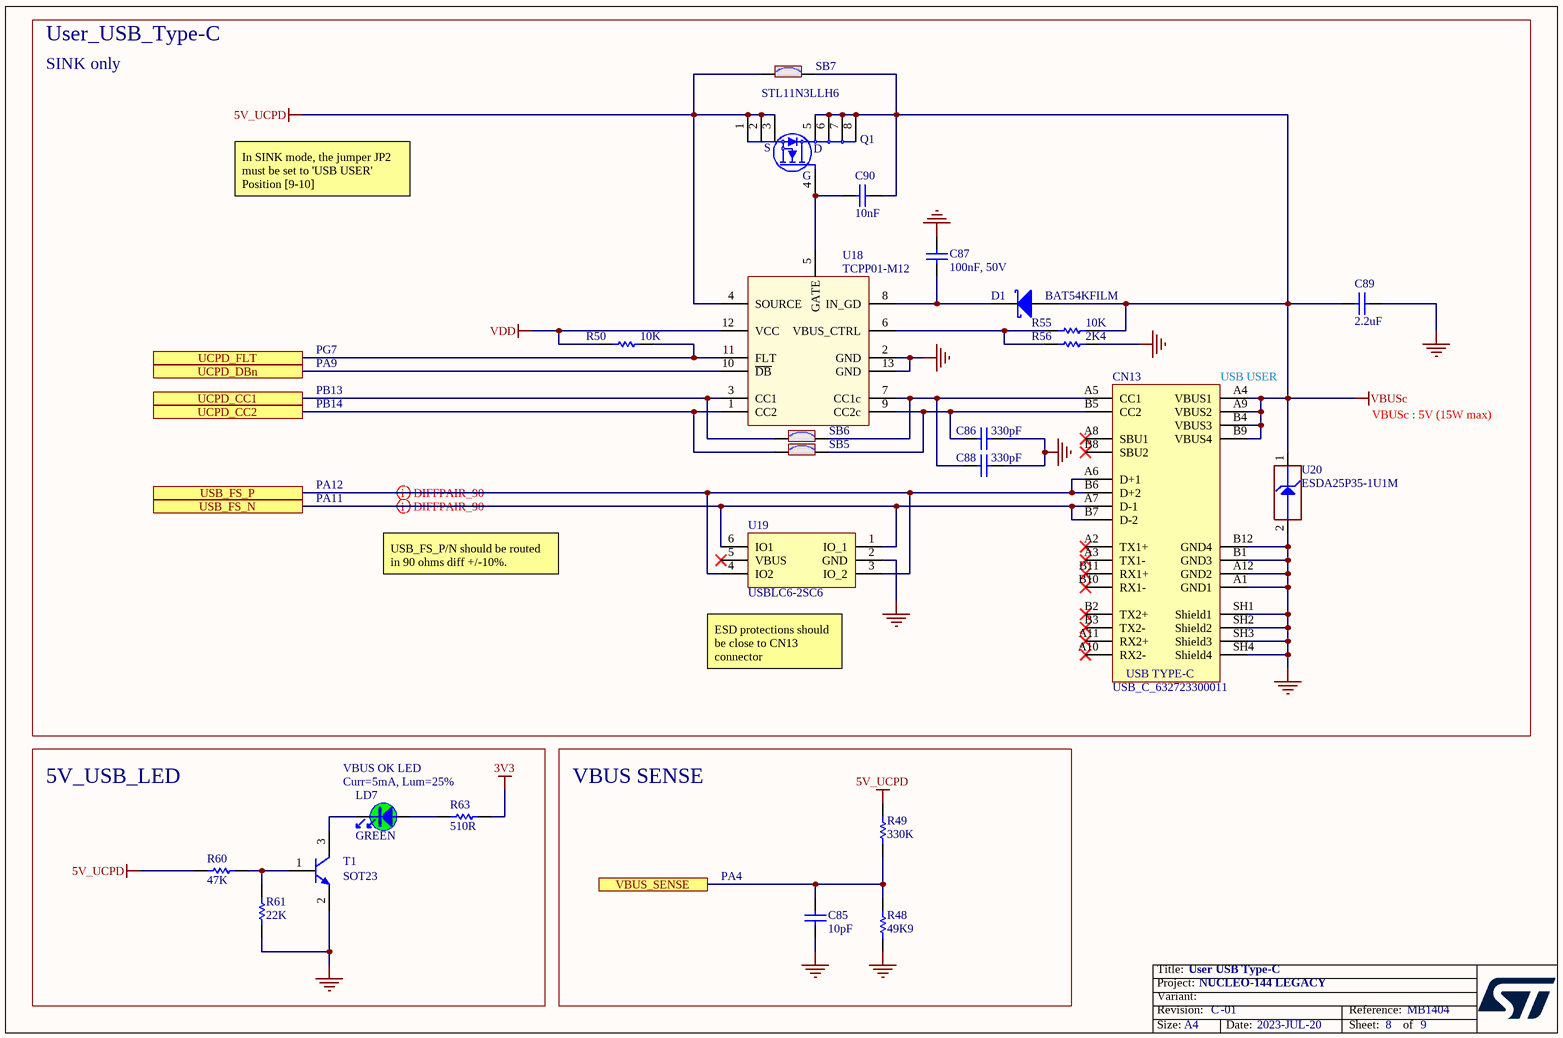
[diagram p3: USB.SchDoc]

### Parts
C85  value 10pF  [C0603]  (hidden comment: Capacitor)
C86  value 330pF  [C0402]  (hidden comment: Capacitor)
C87  value 100nF, 50V  [C0603]  (hidden comment: Capacitor)
C88  value 330pF  [C0402]  (hidden comment: Capacitor)
C89  value 2.2uF  [C0805]  (hidden comment: Capacitor)
C90  value 10nF  [C0402]  (hidden comment: Capacitor)
CN13  value USB_C_632723300011  [CON_USB-TYPEC_WE_632723300011]  (hidden comment: USB_TYPE_C_Receptacle)
D1  value BAT54KFILM  [DIO_SOD523_1A_2K]  (hidden comment: SCHOTTKY_1A_2K)
LD7  value GREEN  [LED_0603_OSRAM_LG-Q396-PS-35_GREEN_1A2K_H0P4]  (hidden comment: LED_green)
Q1  STL11N3LLH6  [MOS_POWERFLAT_3P3X3P3_P065]
R48  value 49K9  [R0603]  (hidden comment: Resistor)
R49  value 330K  [R0603]  (hidden comment: Resistor)
R50  value 10K  [R0402]  (hidden comment: Resistor)
R55  value 10K  [R0402]  (hidden comment: Resistor)
R56  value 2K4  [R0402]  (hidden comment: Resistor)
R60  value 47K  [R0603]  (hidden comment: Resistor)
R61  value 22K  [R0603]  (hidden comment: Resistor)
R63  value 510R  [R0603]  (hidden comment: Resistor)
SB5  SB_ON  [SOLDER-BRIDGE_R0402-0R]  (value not drawn)
SB6  SB_ON  [SOLDER-BRIDGE_R0402-0R]  (value not drawn)
SB7  SB_ON  [SOLDER-BRIDGE_R0402-0R]  (value not drawn)
T1  value SOT23  [NPN_SOT23]  (hidden comment: 9013-SOT23)
U18  TCPP01-M12  [ICC_QFN12L-EPAD_3X3_P050]
U19  USBLC6-2SC6  [ESD_SOT23-6L]
U20  value ESDA25P35-1U1M  [ESD_QFN1610_2N_1K_2A]  (hidden comment: ESD-TRANSIL)

### Blocks framed on the sheet
User_USB_Type-C: C86-C90 CN13 D1 Q1 R50 R55 R56 SB5-SB7 U18-U20
5V_USB_LED: LD7 R60 R61 R63 T1
VBUS SENSE: C85 R48 R49

### Ports
UCPD_CC1, UCPD_CC2, UCPD_DBn, UCPD_FLT, USB_FS_N, USB_FS_P, VBUS_SENSE

### Nets
3V3: R63.2
5V_UCPD: Q1.1(S) Q1.2(S) Q1.3(S) R49.2 R60.1 SB7.1 U18.4(SOURCE)
GND: C85.1 C86.2 C87.2 C88.2 C89.2 CN13.A1(GND1) CN13.A12(GND2) CN13.B1(GND3) CN13.B12(GND4) CN13.SH1(Shield1) CN13.SH2(Shield2) CN13.SH3(Shield3) CN13.SH4(Shield4) R48.1 R56.2 R61.1 T1.2(E) U18.2(GND) U18.13(GND) U19.2(GND) U20.2(GND)
VBUSc: C89.1 C90.2 CN13.A4(VBUS1) CN13.A9(VBUS2) CN13.B4(VBUS3) CN13.B9(VBUS4) D1.1(A) Q1.5(D) Q1.6(D) Q1.7(D) Q1.8(D) R55.2 SB7.2 U20.1(IO1)
VDD: R50.1 U18.12(VCC)
UCPD_CC1: SB6.1 U18.3(CC1) ; port UCPD_CC1
UCPD_CC2: SB5.1 U18.1(CC2) ; port UCPD_CC2
UCPD_DBn: U18.10(~{DB}) ; port UCPD_DBn
UCPD_FLT: R50.2 U18.11(FLT) ; port UCPD_FLT
USB_FS_N: CN13.A7(D-1) CN13.B7(D-2) U19.1(IO_1) U19.6(IO1) ; port USB_FS_N
USB_FS_P: CN13.A6(D+1) CN13.B6(D+2) U19.3(IO_2) U19.4(IO2) ; port USB_FS_P
VBUS_SENSE: C85.2 R48.2 R49.1 ; port VBUS_SENSE
NetC86_1: C86.1 CN13.B5(CC2) SB5.2 U18.9(CC2c)
NetC87_1: C87.1 D1.2(K) U18.8(IN_GD)
NetC88_1: C88.1 CN13.A5(CC1) SB6.2 U18.7(CC1c)
NetC90_1: C90.1 Q1.4(G) U18.5(GATE)
NetLD7_1: LD7.1 R63.1
NetLD7_2: LD7.2 T1.3(C)
NetR55_1: R55.1 R56.1 U18.6(VBUS_CTRL)
NetR60_2: R60.2 R61.2 T1.1(B)

Not connected (* = marked no-connect by the designer): CN13 A2(TX1+)* A3(TX1-)* A8(SBU1)* A10(RX2-)* A11(RX2+)* B2(TX2+)* B3(TX2-)* B8(SBU2)* B10(RX1-)* B11(RX1+)*; U19 5(VBUS)*

### Layout directives
differential pair: USB_FS_N, USB_FS_P

### Notes on the sheet
- SINK only
- In SINK mode, the jumper JP2 must be set to 'USB USER' Position [9-10]
- PA9
- PG7
- (near CN13) USB USER
- PB14
- PB13
- VBUSc : 5V (15W max)
- PA11
- PA12
- USB_FS_P/N should be routed in 90 ohms diff +/-10%.
- (near U19) ESD protections should be close to CN13 connector
- VBUS OK LED
- Curr=5mA, Lum=25%
- PA4
- Title:
- Project:
- Size:
- Revision:
- Variant:
- A4
- -
- Date:
- Reference:
- Sheet:
- of
- (in symbol MCD-02273) USB TYPE-C

### Library data of the parts
C85 = MCD-00637: Capacitor, MLCC, 10pF, 50V, NPO, 5%, 0603, T=0,8mm; Manufacturer_Part_Number: CC0603JRNPO9BN100; Manufacturer: YAGEO; ECCN_US: EAR99; ECCN_EU: NEC; Provided_By: SUBCO; Internal_Part_Number: MCD-00637; Status: Released; Part_Type: Capacitor; Package: C0603; ComponentLink1Description: Datasheet; ComponentLink1URL: http://tunmcdsvn.tun.st.com/Component_Datasheet_Library/Trunk/Capacitors/Yageo_Capacitor_NP0_16V-to-50V
C86 C88 = MCD-01579: Capacitor, MLCC, 330pF, 50V, NPO, +/-5%, 0402, T=0,5mm; Part_Preference: Recommended; Manufacturer: YAGEO; Manufacturer_Part_Number: CC0402JRNPO9BN331; Internal_Part_Number: MCD-01579; Status: Checked; Part_Type: Capacitor; Package: C0402; ComponentLink1URL: http://tunmcdsvn.tun.st.com/Component_Datasheet_Library/Trunk/Capacitors/Yageo_Capacitor_NP0_16V-to-50V; Order_Code_Digikey: 311-1667-1-ND; Order_Code_Farnell: N/A; Order_Code_RS: N/A
C87 = MCD-01099: Capacitor,100nF,50V,X7R,10%,0603; Manufacturer_Part_Number: CC0603KRX7R9BB104; Manufacturer: YAGEO; BMS_Part_Number: 9142278; Provided_By: SUBCO; Internal_Part_Number: MCD-01099; Status: Released; Part_Type: Capacitor; Package: C0603; ComponentLink1Description: Datasheet; ComponentLink1URL: http://tunmcdsvn.tun.st.com/Component_Datasheet_Library/Trunk/Capacitors/Yageo_Multilayer_Capacitor_X7R_series_100pF_to_22uF/Yageo_Mutilayer_Capacitor_X7R_100pF_to_22uF.pdf; ECCN_US: N/A; ECCN_EU: N/A
C89 = MCD-02372: Capacitor, MLCC, 2.2uF, 25V, X7R, +/-10%, 0805, T=1,25mm; Part_Preference: Recommended; Manufacturer: MURATA; Manufacturer_Part_Number: GRM21BR71E225KE11L; Internal_Part_Number: MCD-02372; Status: New; Part_Type: Capacitor; Package: C0805; ComponentLink1URL: http://tunmcdsvn.tun.st.com/Component_Documentation_Library/Trunk/Capacitor/MURATA_GRM_Series/GRM21BR71E225KE11; Order_Code_Digikey: 490-14467; Order_Code_Farnell: 2688538
C90 = MCD-02198: Capacitor, MLCC, 10nF, 50V ,X7R, +/-10%, 0402, T=0.5mm; Part_Preference: Recommended; Manufacturer: YAGEO; Manufacturer_Part_Number: CC0402KRX7R9BB103; Alternate_Manufacturer: TAIYO YUDEN; Alternate_Manufacturer_Part_Number: UMF105B7103KVHF; Order_Code_RS: 6169644; Internal_Part_Number: MCD-02198; Status: Checked; Part_Type: Capacitor; Package: C0402; ComponentLink1URL: http://tunmcdsvn.tun.st.com/Component_Datasheet_Library/Trunk/Capacitors/Yageo_Multilayer_Capacitor_X7R_series_100pF_to_22uF/Yageo_Mutilayer_Capacitor_X7R_100pF_to_22uF.pdf; Order_Code_Digikey: N/A; Order_Code_Farnell: N/A
CN13 = MCD-02273: Connector_USB_TypeC, 24pins, RA, TH, T=1.9mm (USB certified); Part_Preference: Recommended; Manufacturer: WURTH ELEKTRONIK; Manufacturer_Part_Number: 632723300011; Component_Country_Of_Origin: China; ShowFields: YES; ID: 4373; Internal_Part_Number: MCD-02273; Status: Released; Part_Type: Connector; ComponentLink1URL: http://tunmcdsvn.tun.st.com/Component_Datasheet_Library/Trunk/Connectors/WURTH_ELEKTRONIK_USB_TYPE-C_632723300011; Order_Code_Digikey: 732-9618-1-ND; Order_Code_Farnell: 2984404; Order_Code_RS: N/A
D1 = MCD-01677: Small signal Schottky diodes; Part_Type: Diode; Manufacturer: STMICROELECTRONICS; BMS_Part_Number: 9151123; ECCN_US: EAR99; ECCN_EU: NEC; Provided_By: SUBCO; Internal_Part_Number: MCD-01677; Status: Checked; Manufacturer_Part_Number: BAT54KFILM; Package: SOD-523; ComponentLink1Description: Datasheet; ComponentLink1URL: http://tunmcdsvn.tun.st.com/Component_Datasheet_Library/Trunk/Diodes/STM_SCHOTTKY_DOUBLE_BAT54SWFILM/STM_SCHOTTKY_DOUBLE_BAT54SWFILM.pdf
LD7 = MCD-00588: as LD1 on sheet Connectors; Internal_Part_Number: MCD-00588; Status: Released; Package: LED 0603; ComponentLink1Description: Datasheet; ComponentLink1URL: http://tunmcdsvn.tun.st.com/Component_Datasheet_Library/Trunk/Display/OSRAM_LED_GREEN_LG Q396-PS-35; Order_Code_Digikey: LG Q396-PS-35-ND; ECCN_US: n/a; ECCN_EU: n/a
Q1 = MCD-01810: N-channel 30 V, 6 mΩ typ, 11 A STripFET™ H6, Power MOSFET in a PowerFLAT™ 3.3x3.3 package; Part_Type: IC; Manufacturer: STMICROELECTRONICS; BMS_Part_Number: 9153561; ECCN_US: EAR99; ECCN_EU: NEC; Provided_By: SUBCO with ST control; Internal_Part_Number: MCD-01810; Value: STL11N3LLH6; Status: Checked; Manufacturer_Part_Number: STL11N3LLH6; Package: PowerFLAT 3.3x3.3; ComponentLink1Description: Datasheet; ComponentLink1URL: http://tunmcdsvn.tun.st.com/Component_Datasheet_Library/Trunk/IC/STM_POWER_MOSFET_STL11N3LLH6
R48 = MCD-01171: Resistor,49K9,0603,1%; Manufacturer_Part_Number: RC0603FR-0749K9L; Manufacturer: YAGEO; ECCN_US: EAR99; ECCN_EU: NEC; Provided_By: SUBCO; Internal_Part_Number: MCD-01171; Status: Released; Part_Type: Resistor; Package: R0603; ComponentLink1Description: Datasheet; ComponentLink1URL: http://tunmcdsvn.tun.st.com/Component_Datasheet_Library/Trunk/Resistors/Yageo_Resistor_RC0603-series/
R49 = MCD-00458: Resistor,330K,0603,1%,1/10W; Manufacturer_Part_Number: RC0603FR-07330KL; Manufacturer: YAGEO; ECCN_US: EAR99; ECCN_EU: NEC; Provided_By: SUBCO; Internal_Part_Number: MCD-00458; Status: Released; Part_Type: Resistor; Package: R0603; ComponentLink1Description: Datasheet; ComponentLink1URL: http://tunmcdsvn.tun.st.com/Component_Datasheet_Library/Trunk/Resistors/Yageo_Resistor_RC0603-series
R50 R55 = MCD-00053: Resistor,10K,0402,1%,1/16W; BMS_Part_Number: 9131590; Part_Preference: Recommended; Manufacturer: YAGEO; Manufacturer_Part_Number: RC0402FR-0710KL; Internal_Part_Number: MCD-00053; Status: Released; Part_Type: Resistor; Package: R0402; ComponentLink1URL: http://tunmcdsvn.tun.st.com/Component_Datasheet_Library/Trunk/Resistors/Yageo_Resistor_RC0402-series; Order_Code_Digikey: 311-10.0KLRCT-ND; Order_Code_Farnell: 9239359; Order_Code_RS: N/A
R56 = MCD-00433: Resistor, 2K4, 0402, +/-1%, 1/16W; Part_Preference: Recommended; Manufacturer: YAGEO; Manufacturer_Part_Number: RC0402FR-072K4L; Internal_Part_Number: MCD-00433; Status: Released; Part_Type: Resistor; Alternate_Manufacturer: N/A; Alternate_Manufacturer_Part_Number: N/A; Package: 0402; ComponentLink1URL: http://tunmcdsvn.tun.st.com/Component_Documentation_Library/Trunk/Resistor/YAGEO_RC_L_Series; Order_Code_Digikey: 311-2.40KLRCT-ND; Order_Code_Farnell: 1458767; Order_Code_RS: N/A
R60 = MCD-00222: Resistor,47K,0603,1%,1/10W; Manufacturer_Part_Number: RC0603FR-0747KL; Manufacturer: YAGEO; ECCN_US: EAR99; ECCN_EU: NEC; Provided_By: SUBCO; Internal_Part_Number: MCD-00222; Status: Released; Part_Type: Resistor; Package: R0603; ComponentLink1Description: Datasheet; ComponentLink1URL: http://tunmcdsvn.tun.st.com/Component_Datasheet_Library/Trunk/Resistors/Yageo_Resistor_RC0603-series
R61 = MCD-00430: Resistor,22K,0603,1%,1/10W; Manufacturer_Part_Number: RC0603FR-0722KL; Manufacturer: YAGEO; ECCN_US: EAR99; ECCN_EU: NEC; Provided_By: SUBCO; Internal_Part_Number: MCD-00430; Status: Released; Part_Type: Resistor; Package: R0603; ComponentLink1Description: Datasheet; ComponentLink1URL: http://tunmcdsvn.tun.st.com/Component_Datasheet_Library/Trunk/Resistors/Yageo_Resistor_RC0603-series
R63 = MCD-00225: Resistor,510R,0603,1%,1/10W; Manufacturer_Part_Number: RC0603FR-07510RL; Manufacturer: YAGEO; ECCN_US: EAR99; ECCN_EU: NEC; Provided_By: SUBCO; Internal_Part_Number: MCD-00225; Status: Released; Part_Type: Resistor; Package: R0603; ComponentLink1Description: Datasheet; ComponentLink1URL: http://tunmcdsvn.tun.st.com/Component_Datasheet_Library/Trunk/Resistors/Yageo_Resistor_RC0603-series
SB5-SB7 = MCD-01618: as SB8 on sheet Connectors; Internal_Part_Number: MCD-01618; Status: Footprint available; Package: SB0402; ComponentLink1Description: Datasheet; ComponentLink1URL: http://tunmcdsvn.tun.st.com/Component_Datasheet_Library/Trunk/Resistors/Yageo_Resistor_RC0402-series; ECCN_US: n/a; ECCN_EU: n/a
T1 = MCD-00073: NPN Bipolar Transistor; Manufacturer_Part_Number: BSR14; Manufacturer: ON SEMICONDUCTOR; Part_Type: IC; Alternate_Manufacturer_Part_Number: MMBT2222ALT1G / MMBT2222ALT3G; Provided_By: SUBCO; ECCN_US: EAR99; ECCN_EU: NEC; Revision: *; Internal_Part_Number: MCD-00073; ComponentLink1Description: Datasheet; Status: Released; ComponentLink1URL: http://tunmcdsvn.tun.st.com/Component_Datasheet_Library/Trunk/IC/NXP_Transistor_BSR14; Alternate_Manufacturer: ON SEMICONDUCTOR
U18 = MCD-01809: USB Type-C Port Protection for USB Power Delivery, PPS compliant; Part_Type: IC; Manufacturer: STMICROELECTRONICS; BMS_Part_Number: 9151145; ECCN_US: EAR99; ECCN_EU: NEC; Provided_By: SUBCO with ST control; Internal_Part_Number: MCD-01809; Value: TCPP01-M12; Status: Checked; Manufacturer_Part_Number: TCPP01-M12; Package: QFN-12L; ComponentLink1Description: Datasheet; ComponentLink1URL: http://tunmcdsvn.tun.st.com/Component_Datasheet_Library/Trunk/IC/STM_UCPD_Protection_TCPP01-M12
U19 = MCD-00163: Very low capacitance ESD protection; Part_Type: IC; Manufacturer: STMICROELECTRONICS; BMS_Part_Number: 9151075; Provided_By: SUBCO with ST control; ECCN_US: EAR99; ECCN_EU: NEC; Internal_Part_Number: MCD-00163; Value: USBLC6-2SC6; Status: Released; Manufacturer_Part_Number: USBLC6-2SC6; ComponentLink1Description: Datasheet; ComponentLink1URL: http://tunmcdsvn.tun.st.com/Component_Datasheet_Library/Trunk/Diodes/STM_ESD_USBLC6-2
U20 = MCD-01207: High power Transient voltage suppressor:25V/35A EOS and ESD transients protection.; Part_Type: Diode; Manufacturer: STMICROELECTRONICS; BMS_Part_Number: 9179045; ECCN_US: EAR99; ECCN_EU: NEC; Provided_By: SUBCO with ST control; Internal_Part_Number: MCD-01207; Status: Checked; Manufacturer_Part_Number: ESDA25P35-1U1M; Package: QFN1610; ComponentLink1Description: Datasheet; ComponentLink1URL: http://tunmcdsvn.tun.st.com/Component_Datasheet_Library/Trunk/Diodes/STM_ESD_ESDA25P35-1U1M